# Altium schematic sheet 04-Ethernet.SchDoc: Ethernet PHY
size A3; Date: 01/01/2016; Author: Frédéric Renet; Organization: APTUSTECH; Address2: 8 Rue Esperandieu; Address3: 13004 Marseille; Address4: FRANCE; DocumentNumber: 123; Revision: 1.0; SheetNumber: 5; SheetTotal: 6
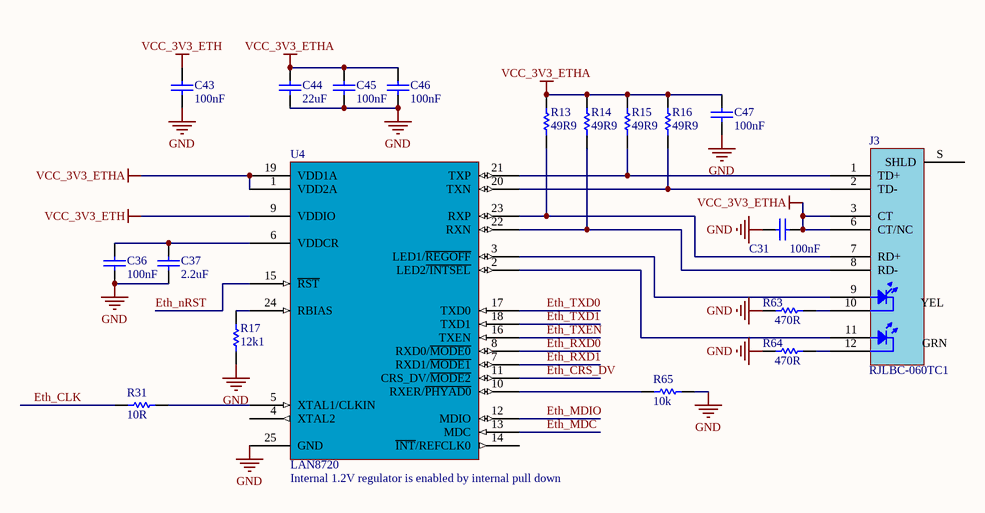
[diagram p0: 04-Ethernet.SchDoc]

## Parts
C31  value 100nF  [CAPC1608X06N]  (hidden comment: 100nF 25V 0603 X5R)
C36  value 100nF  [CAPC1608X06N]  (hidden comment: 100nF 25V 0603 X5R)
C37  value 2.2uF  [CAPC1608X06N]  (hidden comment: 2.2uF 10V 0603 X5R)
C43  value 100nF  [CAPC1608X06N]  (hidden comment: 100nF 25V 0603 X5R)
C44  value 22uF  [CAPC1608X06N]  (hidden comment: 22uF 6.3V 0603 X5R)
C45  value 100nF  [CAPC1608X06N]  (hidden comment: 100nF 25V 0603 X5R)
C46  value 100nF  [CAPC1608X06N]  (hidden comment: 100nF 25V 0603 X5R)
C47  value 100nF  [CAPC1608X06N]  (hidden comment: 100nF 25V 0603 X5R)
J3  RJLBC-060TC1  [RJLBC-060TC1]
R13  value 49R9  [RESC1608X06N]  (hidden comment: 49R9_0603)
R14  value 49R9  [RESC1608X06N]  (hidden comment: 49R9_0603)
R15  value 49R9  [RESC1608X06N]  (hidden comment: 49R9_0603)
R16  value 49R9  [RESC1608X06N]  (hidden comment: 49R9_0603)
R17  value 12k1  [RESC1608X06N]  (hidden comment: 12k1_0603)
R31  value 10R  [RESC1608X06N]  (hidden comment: 10R_0603)
R63  value 470R  [RESC1608X06N]  (hidden comment: 470R_0603)
R64  value 470R  [RESC1608X06N]  (hidden comment: 470R_0603)
R65  value 10k  [RESC1608X06N]  (hidden comment: 10k_0603)
U4  LAN8720  [QFN50P400X400X100_HS-25N]

## Nets
GND: C31.2 C36.2 C37.1 C43.2 C44.1 C45.2 C46.2 C47.2 R17.1 R63.1 R64.1 R65.1 U4.25(GND)
VCC_3V3_ETH: C43.1 U4.9(VDDIO)
VCC_3V3_ETHA: C31.1 C44.2 C45.1 C46.1 C47.1 J3.3(CT) J3.6(CT/NC) R13.2 R14.2 R15.2 R16.2 U4.1(VDD2A) U4.19(VDD1A)
Eth_CLK: R31.1
Eth_CRS_DV: U4.11(CRS_DV/~{MODE2})
Eth_MDC: U4.13(MDC)
Eth_MDIO: U4.12(MDIO)
Eth_nRST: U4.15(~{RST})
Eth_RXD0: U4.8(RXD0/~{MODE0})
Eth_RXD1: U4.7(RXD1/~{MODE1})
Eth_TXD0: U4.17(TXD0)
Eth_TXD1: U4.18(TXD1)
Eth_TXEN: U4.16(TXEN)
NetC36_1: C36.1 C37.2 U4.6(VDDCR)
NetJ3_1: J3.1(TD+) R15.1 U4.21(TXP)
NetJ3_2: J3.2(TD-) R16.1 U4.20(TXN)
NetJ3_7: J3.7(RD+) R13.1 U4.23(RXP)
NetJ3_8: J3.8(RD-) R14.1 U4.22(RXN)
NetJ3_9: J3.9(P9) U4.3(LED1/~{REGOFF})
NetJ3_10: J3.10(P10) R63.2
NetJ3_11: J3.11(P11) U4.2(LED2~{/INTSEL})
NetJ3_12: J3.12(P12) R64.2
NetR17_2: R17.2 U4.24(RBIAS)
NetR31_2: R31.2 U4.5(XTAL1/CLKIN)
NetR65_2: R65.2 U4.10(RXER/~{PHYAD0})

Not connected (* = marked no-connect by the designer): J3 S(SHLD); U4 4(XTAL2) 14(~{INT}/REFCLK0)

## Notes on the sheet
- (near U4) Internal 1.2V regulator is enabled by internal pull down
- Title
- Size:
- Date:
- A3
- Number:
- Author:
- Revision:
- Sheet
- of
- File:
- (in symbol RJLBC-060TC1) YEL; GRN

## Library data of the parts
C31 C36 C43 C45-C47 = 100nF 25V 0603 X5R: Tolerance: 10%; Voltage: 25V; Supplier1: Digikey; Supplier2: Mouser; Supplier3: Farnell; RefSupplier1: 587-1245-1-ND; RefSupplier2: *; RefSupplier3: *; Case: 0603; Material: X5R
C37 = 2.2uF 10V 0603 X5R: Tolerance: 10%; Voltage: 10V; Supplier1: Digikey; Supplier2: Mouser; Supplier3: Farnell; RefSupplier1: 1276-1085-1-ND; RefSupplier2: *; RefSupplier3: *; Case: 0603; Material: X5R
C44 = 22uF 6.3V 0603 X5R: Tolerance: 10%; Voltage: 6.3V; Supplier1: Digikey; Supplier2: Mouser; Supplier3: Farnell; RefSupplier1: 445-8028-2-ND; RefSupplier2: *; RefSupplier3: *; Case: 0603; Material: X5R
J3 = RJLBC-060TC1: Modular Jack with Magnetics Shield LEDS  RJLBC-060TC1; Manufacturer: TAIMAG; PartNumber: RJLBC-060TC1
R13-R16 = 49R9: Resistor 49R9 0603 1%; Case: 0603; Tolerance: 1%; Size: 0603, 1.6x0.8x0.8mm; RefSupplier1: 311-49.9HRCT-ND; RefSupplier2: *; RefSupplier3: *; Supplier1: Digikey; Supplier2: *; Supplier3: *
R17 = 12k1: Resistor 12k1 0603 1%; Case: 0603; Tolerance: 1%; Size: 0603, 1.6x0.8x0.8mm; RefSupplier1: 311-12.1KHRCT-ND; RefSupplier2: *; RefSupplier3: *; Supplier1: Digikey; Supplier2: *; Supplier3: *
R31 = 10R: Resistor 10R 0603 1%; Case: 0603; Tolerance: 1%; Size: 0603, 1.6x0.8x0.8mm; RefSupplier1: 311-10.0HRCT-ND; RefSupplier2: *; RefSupplier3: *; Supplier1: Digikey; Supplier2: *; Supplier3: *
R63 R64 = 470R: Resistor 470R 0603 1%; Case: 0603; Tolerance: 1%; Size: 0603, 1.6x0.8x0.8mm; Supplier1: Digikey; Supplier2: *; Supplier3: *; RefSupplier1: 311-470HRCT-ND; RefSupplier2: *; RefSupplier3: *
R65 = 10k: Resistor 10k 0603 1%; Case: 0603; Tolerance: 1%; Size: 0603, 1.6x0.8x0.8mm; RefSupplier1: 311-10.0KHRCT-ND; RefSupplier2: *; RefSupplier3: *; Supplier1: Digikey; Supplier2: *; Supplier3: *
U4 = LAN8720: LAN8720 RMII 10/100 Ethernet  Transceiver QFN24; PartNumber: LAN8720A-CP-ABC; Manufacturer: Microchip; Supplier1: Digikey; RefSupplier1: LAN8720A-CP-ABC-ND; Case: QFN24